# Altium schematic sheet Glucometer-E.C.- Full V1.1.SchDoc
size Letter; PageSetup: Record=PageOptions|CenterHorizontal=True|CenterVertical=True|PrintScale=0.95|XCorrection=1.00|YCorrection=1.00|PrintKind=2|BorderSize=5000000|LeftOffset=0|BottomOffset=0|Orientation=2|PaperLength=1000|PaperWidth=1000|Scale=100|PaperSource=7|PrintQuality=-4|MediaType=1|DitherType=10|PaperKind=Carta|PrintScaleMode=1
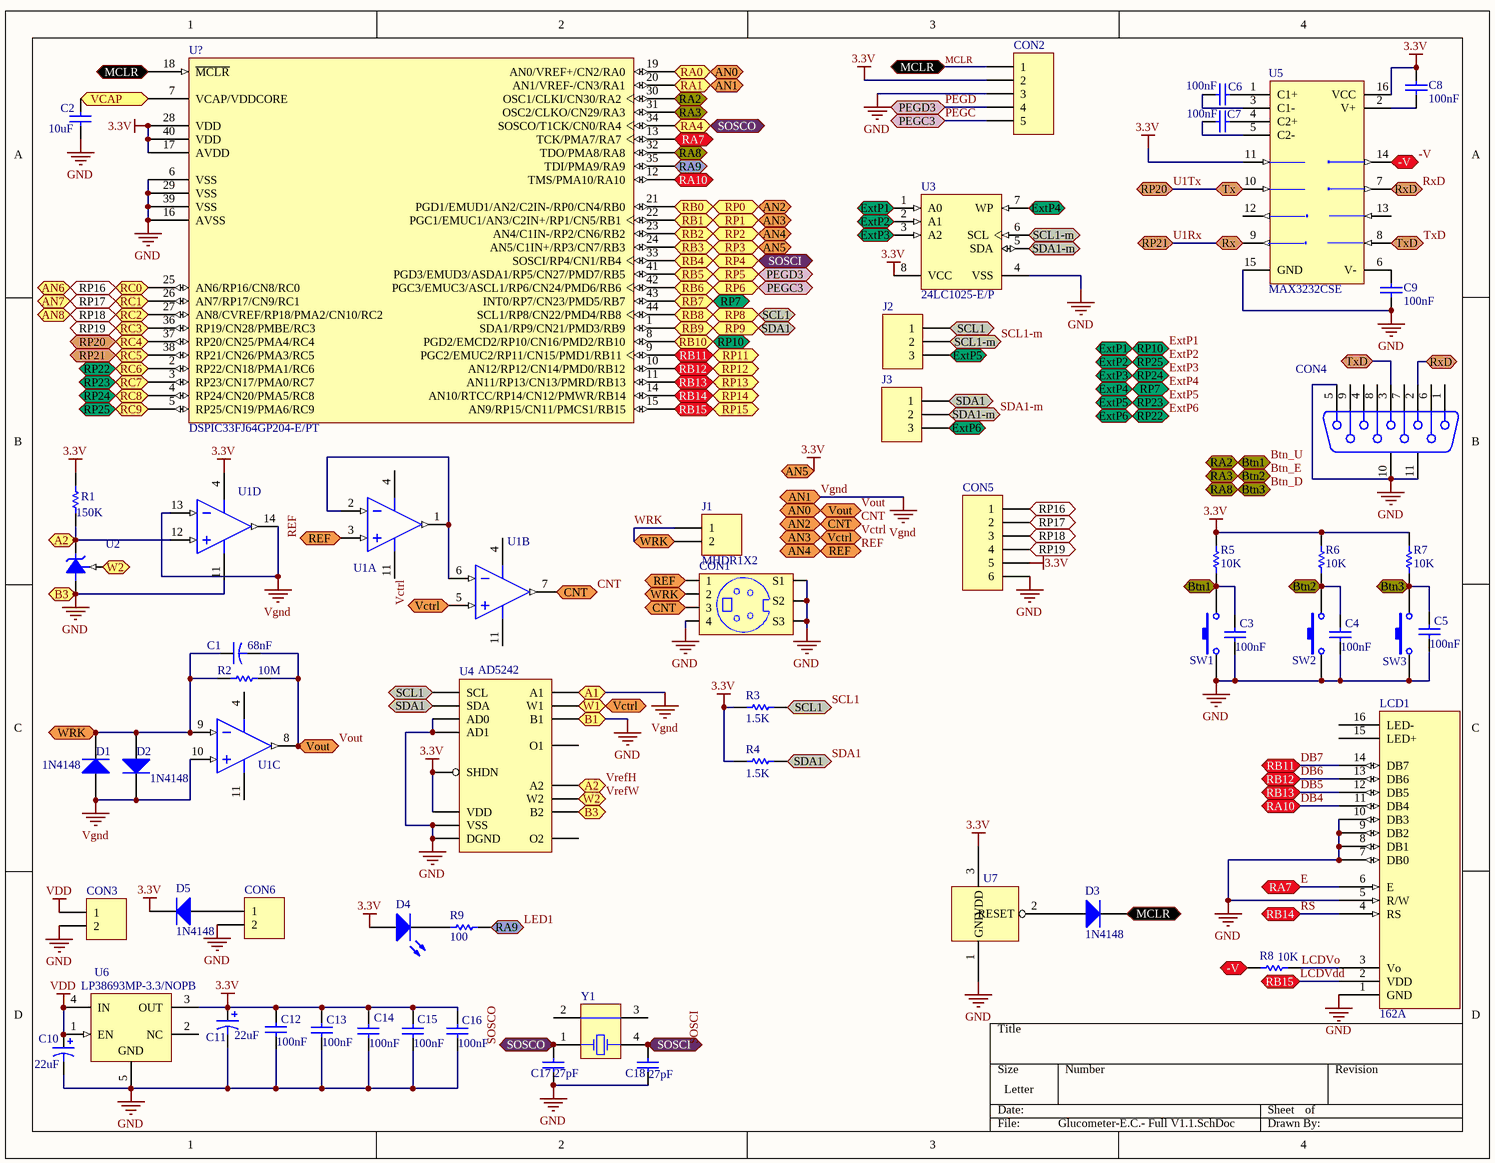
[diagram p0: Glucometer-E.C.- Full V1.1.SchDoc]

## Parts
C1  value 68nF  [CAPC1608N]  (hidden comment: Cap2)
C2  value 10uF  [CAPC2012N]  (hidden comment: Cap)
C3  value 100nF  [CAPC1608N]  (hidden comment: Cap)
C4  value 100nF  [CAPC1608N]  (hidden comment: Cap)
C5  value 100nF  [CAPC1608N]  (hidden comment: Cap)
C6  value 100nF  [RESC1608N]  (hidden comment: Cap)
C7  value 100nF  [RESC1608N]  (hidden comment: Cap)
C8  value 100nF  [RESC1608N]  (hidden comment: Cap)
C9  value 100nF  [RESC1608N]  (hidden comment: Cap)
C10  value 22uF  [C-4x4]  (hidden comment: Cap Pol2)
C11  value 22uF  [C-4x4]  (hidden comment: Cap Pol2)
C12  value 100nF  [CAPC1608N]  (hidden comment: Cap)
C13  value 100nF  [CAPC1608N]  (hidden comment: Cap)
C14  value 100nF  [CAPC1608N]  (hidden comment: Cap)
C15  value 100nF  [CAPC1608N]  (hidden comment: Cap)
C16  value 100nF  [CAPC1608N]  (hidden comment: Cap)
C17  value 27pF  [CAPC1608N]  (hidden comment: Cap)
C18  value 27pF  [CAPC1608N]  (hidden comment: Cap)
CON1  (no value)  [CDIN2.6-3H4A]
CON2  Header 5  [HDR1X5]  (value not drawn)
CON3  Header 2  [HDR1X2]  (value not drawn)
CON4  D Connector 9  [DSUB1.385-2H9]  (value not drawn)
CON5  Header 6  [HDR1X6]  (value not drawn)
CON6  Header 2  [HDR1X2]  (value not drawn)
D1  1N4148  [CD3216-1206]
D2  1N4148  [CD3216-1206]
D3  1N4148  [CD3216-1206]
D4  LED2  [3.2X1.6X1.1]  (value not drawn)
D5  1N4148  [DO-35]
J1  MHDR1X2  [MHDR1X2]
J2  Header 3  [HDR1X3]  (value not drawn)
J3  Header 3  [HDR1X3]  (value not drawn)
LCD1  162A  [HDR1X14]
R1  value 150K  [RESC3216N]  (hidden comment: Res1)
R2  value 10M  [RESC2012N]  (hidden comment: Res1)
R3  value 1.5K  [RESC2012N]  (hidden comment: Res1)
R4  value 1.5K  [RESC2012N]  (hidden comment: Res1)
R5  value 10K  [RESC2012N]  (hidden comment: Res1)
R6  value 10K  [RESC2012N]  (hidden comment: Res1)
R7  value 10K  [RESC2012N]  (hidden comment: Res1)
R8  value 10K  [RESC2012N]  (hidden comment: Res1)
R9  value 100  [RESC2012N]  (hidden comment: Res1)
SW1  SW-PB  [DPST-4]  (value not drawn)
SW2  SW-PB  [DPST-4]  (value not drawn)
SW3  SW-PB  [DPST-4]  (value not drawn)
U1  LMC6044IN  [M14A_N]  (value not drawn)  (parts A,B,C,D of 4)
U2  LM4041CEM3-ADJ/NOPB  [MF03A_N]  (value not drawn)
U3  24LC1025-E/P  [PDIP300-P8]
U4  AD5242  [R-16N_N]
U5  MAX3232CSE  [NSO16_N]
U6  LP38693MP-3.3/NOPB  [MP05A_N]
U7  Supply Voltage Supervisor  [SOT23]  (value not drawn)
U?  DSPIC33FJ64GP204-E/PT  [TQFP-PT44_N]
Y1  ECS-240-20-7S  [ECX-3S]  (value not drawn)

## Ports
-V, A1, A2, AN0, AN1, AN2, AN3, AN4, AN5, AN6, AN7, AN8, B1, B3, Btn1, Btn2, Btn3, CNT, ExtP1, ExtP2, ExtP3, ExtP4, ExtP5, ExtP6, MCLR, PEGC3, PEGD3, RA0, RA1, RA2, RA3, RA4, RA7, RA8, RA9, RA10, RB0, RB1, RB2, RB3, RB4, RB5, RB6, RB7, RB8, RB9, RB10, RB11, RB12, RB13, RB14, RB15, RC0, RC1, RC2, RC3, RC4, RC5, RC6, RC7, RC8, RC9, REF, RP0, RP1, RP2, RP3, RP4, RP5, RP6, RP7, RP8, RP9, RP10, RP11, RP12, RP13, RP14, RP15, RP16, RP17, RP18, RP19, RP20, RP21, RP22, RP23, RP24, RP25, Rx, RxD, SCL1, SCL1-m, SDA1, SDA1-m, SOSCI, SOSCO, Tx, TxD, VCAP, Vctrl, Vout, W1, W2, WRK

## Nets
3.3V: C8.1 C11.1 C12.2 C13.2 C14.2 C15.2 C16.2 CON2.2 CON5.5 D4.1(A) D5.2(K) R1.2 R3.1 R4.1 R5.2 R6.2 R7.2 U1.4(V+) U3.8(VCC) U4.5(VDD) U4.6(SHDN) U5.11(T1IN) U5.16(VCC) U6.3(OUT) U7.3(VDD) U?.17(AVDD) U?.24(AN5/C1IN+/RP3/CN7/RB3) U?.28(VDD) U?.40(VDD) ; port RP3, port RB3, port AN5
GND: C2.1 C3.1 C4.1 C5.1 C9.2 C10.2 C11.2 C12.1 C13.1 C14.1 C15.1 C16.1 C17.1 C18.1 CON1.4 CON1.MH1(S1) CON1.MH2(S2) CON1.MH3(S3) CON2.3 CON3.2 CON4.5 CON4.10(MH1) CON4.11(MH2) CON5.6 CON6.2 LCD1.1(GND) LCD1.5(R/W) LCD1.7(DB0) LCD1.8(DB1) LCD1.9(DB2) LCD1.10(DB3) SW1.1 SW2.1 SW3.1 U1.11(V-) U2.3(-V) U3.4(VSS) U4.4(B1) U4.9(AD0) U4.10(AD1) U4.11(DGND) U4.12(VSS) U4.14(B2) U5.15(GND) U6.5(GND) U7.1(GND) U?.6(VSS) U?.16(AVSS) U?.29(VSS) U?.39(VSS) ; port B1, port B3
VDD: C10.1 CON3.1 U6.1(EN) U6.4(IN)
Vgnd: D1.1(A) D2.2(K) U1.10(IN3+) U1.13(IN4-) U1.14(OUT4) U4.2(A1) U?.20(AN1/VREF-/CN3/RA1) ; port RA1, port AN1, port A1
-V: R8.2 U5.14(T1OUT) ; port -V
AN6: CON5.1 U?.25(AN6/RP16/CN8/RC0) ; port RP16, port AN6, port RC0
AN7: CON5.2 U?.26(AN7/RP17/CN9/RC1) ; port AN7, port RC1, port RP17
AN8: CON5.3 U?.27(AN8/CVREF/RP18/PMA2/CN10/RC2) ; port AN8, port RC2, port RP18
Btn_D: C5.2 R7.1 SW3.2 U?.32(TDO/PMA8/RA8) ; port RA8, port Btn3
Btn_E: C4.2 R6.1 SW2.2 U?.31(OSC2/CLKO/CN29/RA3) ; port RA3, port Btn2
Btn_U: C3.2 R5.1 SW1.2 U?.30(OSC1/CLKI/CN30/RA2) ; port Btn1, port RA2
CNT: CON1.3 U1.7(OUT2) U?.21(PGD1/EMUD1/AN2/C2IN-/RP0/CN4/RB0) ; port RB0, port RP0, port CNT, port AN2
DB4: LCD1.11(DB4) U?.12(TMS/PMA10/RA10) ; port RA10
DB5: LCD1.12(DB5) U?.11(AN11/RP13/CN13/PMRD/RB13) ; port RP13, port RB13
DB6: LCD1.13(DB6) U?.10(AN12/RP12/CN14/PMD0/RB12) ; port RP12, port RB12
DB7: LCD1.14(DB7) U?.9(PGC2/EMUC2/RP11/CN15/PMD1/RB11) ; port RP11, port RB11
E: LCD1.6(E) U?.13(TCK/PMA7/RA7) ; port RA7
ExtP1: U3.1(A0) U?.8(PGD2/EMCD2/RP10/CN16/PMD2/RB10) ; port RB10, port ExtP1, port RP10
ExtP2: U3.2(A1) U?.5(RP25/CN19/PMA6/RC9) ; port ExtP2, port RC9, port RP25
ExtP3: U3.3(A2) U?.4(RP24/CN20/PMA5/RC8) ; port ExtP3, port RC8, port RP24
ExtP4: U3.7(WP) U?.43(INT0/RP7/CN23/PMD5/RB7) ; port RB7, port ExtP4, port RP7
ExtP5: J2.3 U?.3(RP23/CN17/PMA0/RC7) ; port ExtP5, port RC7, port RP23
ExtP6: J3.3 U?.2(RP22/CN18/PMA1/RC6) ; port ExtP6, port RC6, port RP22
LCDVdd: LCD1.2(VDD) U?.15(AN9/RP15/CN11/PMCS1/RB15) ; port RP15, port RB15
LCDVo: LCD1.3(Vo) R8.1
LED1: R9.1 U?.35(TDI/PMA9/RA9) ; port RA9
MCLR: CON2.1 D3.2(K) U?.18(~{MCLR}) ; port MCLR
PEGC: CON2.5 U?.42(PGC3/EMUC3/ASCL1/RP6/CN24/PMD6/RB6) ; port RB6, port RP6, port PEGC3
PEGD: CON2.4 U?.41(PGD3/EMUD3/ASDA1/RP5/CN27/PMD7/RB5) ; port RB5, port RP5, port PEGD3
RC3: CON5.4 U?.36(RP19/CN28/PMBE/RC3) ; port RC3, port RP19
REF: CON1.1 U1.3(IN1+) U?.23(AN4/C1IN-/RP2/CN6/RB2) ; port RB2, port RP2, port REF, port AN4
RS: LCD1.4(RS) U?.14(AN10/RTCC/RP14/CN12/PMWR/RB14) ; port RP14, port RB14
RxD: CON4.2 U5.7(T2OUT) ; port RxD
SCL1: J2.1 R3.2 U4.7(SCL) U?.44(SCL1/RP8/CN22/PMD4/RB8) ; port RP8, port SCL1, port RB8
SCL1-m: J2.2 U3.6(SCL) ; port SCL1-m
SDA1: J3.1 R4.2 U4.8(SDA) U?.1(SDA1/RP9/CN21/PMD3/RB9) ; port RP9, port SDA1, port RB9
SDA1-m: J3.2 U3.5(SDA) ; port SDA1-m
SOSCI: C18.2 U?.33(SOSCI/RP4/CN1/RB4) Y1.4(OSC2) ; port RP4, port RB4, port SOSCI
SOSCO: C17.2 U?.34(SOSCO/T1CK/CN0/RA4) Y1.1(OSC1) ; port RA4, port SOSCO
TxD: CON4.3 U5.8(R2IN) ; port TxD
U1Rx: U5.9(R2OUT) U?.38(RP21/CN26/PMA3/RC5) ; port RP21, port Rx, port RC5
U1Tx: U5.10(T2IN) U?.37(RP20/CN25/PMA4/RC4) ; port RP20, port Tx, port RC4
VCAP: C2.2 U?.7(VCAP/VDDCORE) ; port VCAP
Vctrl: U1.5(IN2+) U4.3(W1) U?.22(PGC1/EMUC1/AN3/C2IN+/RP1/CN5/RB1) ; port RB1, port RP1, port AN3, port Vctrl, port W1
Vout: C1.2 R2.1 U1.8(OUT3) U?.19(AN0/VREF+/CN2/RA0) ; port AN0, port Vout, port RA0
VrefH: R1.1 U1.12(IN4+) U2.2(+V) U4.16(A2) ; port A2
VrefW: U2.1(FB) U4.15(W2) ; port W2
WRK: C1.1 CON1.2 D1.2(K) D2.1(A) J1.1 J1.2 R2.2 U1.9(IN3-) ; port WRK
NetC6_1: C6.1 U5.1(C1+)
NetC6_2: C6.2 U5.3(C1-)
NetC7_1: C7.1 U5.4(C2+)
NetC7_2: C7.2 U5.5(C2-)
NetC8_2: C8.2 U5.2(V+)
NetC9_1: C9.1 U5.6(V-)
NetCON6_1: CON6.1 D5.1(A)
NetD3_1: D3.1(A) U7.2(RESET)
NetD4_2: D4.2(K) R9.2
NetU1_1: U1.1(OUT1) U1.2(IN1-) U1.6(IN2-)

Not connected (* = marked no-connect by the designer): CON4 1 4 6 7 8 9; LCD1 15(LED+) 16(LED-); U4 1(O1) 13(O2); U5 12(R1OUT) 13(R1IN); U6 2(NC); Y1 2(COM) 3(COM)

## Library data of the parts
C1 = Cap2: Capacitor; Published: 23-Sep-2002; PackageReference: CAPR5-4X5; Publisher: Altium Limited; PackageDescription: Capacitor; 2 Leads
C2-C9 C12-C18 = Cap: Capacitor; Published: 8-Jun-2000; LatestRevisionDate: 17-Jul-2002; LatestRevisionNote: Re-released for DXP Platform.; PackageReference: RAD-0.3; Publisher: Altium Limited; PackageDescription: Radial Cap, Thru-Hole; 2 Leads; 0.3 in Pin Spacing
C10 C11 = Cap Pol2: Polarized Capacitor (Axial); Published: 8-Jun-2000; LatestRevisionDate: 17-Jul-2002; LatestRevisionNote: Re-released for DXP Platform.; PackageReference: POLAR0.8; Publisher: Altium Limited; PackageDescription: Polarized Capacitor; 2 Leads
CON1 = MiniDin 4Pins - SuperVideo: MiniDin 4 Pins
CON2 = Header 5: Header, 5-Pin; LatestRevisionDate: 17-Jul-2002; LatestRevisionNote: Re-released for DXP Platform.; Publisher: Altium Limited
CON3 CON6 = Header 2: Header, 2-Pin; LatestRevisionDate: 17-Jul-2002; LatestRevisionNote: Re-released for DXP Platform.; Publisher: Altium Limited
CON4 = D Connector 9: Receptacle Assembly, 9 Position, Right Angle; PackageDocument: O; Positions: 9; Published: 15-Jun-2001; LatestRevisionDate: 17-Jul-2002; LatestRevisionNote: Re-released for DXP Platform.; DatasheetDocument: 1-Sep-1999; PackageReference: 788750; Publisher: Altium Limited; Orientation: Right Angle; Gender: Receptacle
CON5 = Header 6: Header, 6-Pin; LatestRevisionDate: 17-Jul-2002; LatestRevisionNote: Re-released for DXP Platform.; Publisher: Altium Limited
D1-D3 D5 = 1N4148: High Conductance Fast Diode; Published: 8-Jun-2000; LatestRevisionDate: 17-Jul-2002; LatestRevisionNote: Re-released for DXP Platform.; DatasheetDocument: 1997; PackageReference: DO-35; Publisher: Altium Limited; Code_JEDEC: DO-204-AH; ComponentLink1Description: Manufacturer Link; ComponentLink1URL: http://www.fairchildsemi.com/; ComponentLink2Description: Datasheet; ComponentLink2URL: http://www.fairchildsemi.com/ds/1N%2F1N4148.pdf
D4 = LED2: Typical RED, GREEN, YELLOW, AMBER GaAs LED; Published: 8-Jun-2000; LatestRevisionDate: 17-Jul-2002; LatestRevisionNote: Re-released for DXP Platform.; PackageVersion: Feb-2002; PackageReference: 3.2X1.6X1.1; Publisher: Altium Limited; PackageDescription: SM LED; 2 Flat Leads
J1 = MHDR1X2: Header, 2-Pin; LatestRevisionDate: 17-Jul-2002; LatestRevisionNote: Re-released for DXP Platform.; Publisher: Altium Limited
J2 J3 = Header 3: Header, 3-Pin; LatestRevisionDate: 17-Jul-2002; LatestRevisionNote: Re-released for DXP Platform.; Publisher: Altium Limited
LCD1 = 162A: 16 char * 2 line LCD character display with b/light
R1-R9 = Res1: Resistor; Published: 8-Jun-2000; LatestRevisionDate: 17-Jul-2002; LatestRevisionNote: Re-released for DXP Platform.; PackageReference: AXIAL-0.3; Publisher: Altium Limited; PackageDescription: Axial Device, Thru-Hole; 2 Leads; 0.3 in Pin Spacing
SW1-SW3 = SW-PB: Switch; Published: 24-Mar-1999; LatestRevisionDate: 17-Jul-2002; LatestRevisionNote: Re-released for DXP Platform.; PackageReference: SPST-2; Publisher: Altium Limited; PackageDescription: Switch; 2 Leads
U1 = LMC6044IN: CMOS Quad Micropower Operational Amplifier, 14-pin MDIP; Manufacturer: National Semiconductor; PackageTopMarking: NSUZXYYTTE#*LMC6044IN; PowerWise: Y; CompType: Amplifiers; Published: 4-Dec-2008; LatestRevisionDate: 13-Jan-2009; LatestRevisionNote: Sim Model Added.; DatasheetVersion: Aug-2000; PackageVersion: revG, May-2006; PackageReference: N14A; Publisher: Altium Limited; PackageDescription: MDIP, .750 x .250 x.130in, 14 Lead, .100in Pitch; Supplier 1: Farnell; Supplier Part Number 1: 9494634; PartNumber: LMC6044IN; RoHS: N; PinCount: 14; Code_JEDEC: MS-001-AA; ComponentLink1Description: LMC6044 Datasheet; ComponentLink1URL: http://www.national.com/ds/LM/LMC6044.pdf; ComponentLink2Description: LMC6044 Web Page; ComponentLink2URL: http://www.national.com/pf/LM/LMC6044.html; ComponentLink3Description: N14A Package Page; ComponentLink3URL: http://www.national.com/packaging/folders/n14a.html
U2 = LM4041CEM3-ADJ/NOPB: Precision Micropower Shunt Voltage Reference, 3-pin SOT-23, Pb-Free; Manufacturer: National Semiconductor; PackageTopMarking: RAC*XTT; PowerWise: N; CompType: Voltage Reference IC; Published: 1-Mar-2010; DatasheetVersion: Mar-2005; PackageVersion: revB, Mar-2003; PackageReference: MF03A; Publisher: Altium Limited; PackageDescription: Molded SOT-23, .115 x .051 x .037in Body, 3 Lead, .075 in Pitch; Supplier 1: Digi-Key; Supplier Part Number 1: LM4041CEM3-ADJTR-ND; Supplier 2: Digi-Key; Supplier Part Number 2: LM4041CEM3-ADJCT-ND; Supplier 3: Digi-Key; Supplier Part Number 3: LM4041CEM3-ADJDKR-ND; Supplier 4: Farnell; Supplier Part Number 4: 1673994; PartNumber: LM4041CEM3-ADJ/NOPB; RoHS: Y; PinCount: 3; ComponentLink1Description: LM4041 Datasheet; ComponentLink1URL: http://www.national.com/ds/LM/LM4041.pdf; ComponentLink2Description: LM4041 Web Page; ComponentLink2URL: http://www.national.com/pf/LM/LM4041.html; ComponentLink3Description: MF03A Package Page; ComponentLink3URL: http://www.national.com/packaging/folders/mf03a.html
U3 = 24LC1025-E/P: 1 Mbit, 400kHz, 2.5V, I2C Serial EEPROM, 8-Pin PDIP, Extended Temperature; Published: 29-Jan-2009; DatasheetVersion: revF, Oct-2008; PackageVersion: revBB, Aug-2009; PackageReference: PDIP300-P8; Publisher: Altium Limited; PackageDescription: 8-Lead Plastic Dual In-Line (P) - 300 mil Body [PDIP]; Supplier 1: Digi-Key; Supplier Part Number 1: 24LC1025-E/P-ND; Supplier 2: Farnell; Supplier Part Number 2: 1815993; Code_JEDEC: MS-001; ComponentLink1Description: Datasheet; ComponentLink1URL: http://ww1.microchip.com/downloads/en/DeviceDoc/21941F.pdf; ComponentLink2Description: Packaging Specification; ComponentLink2URL: http://www.microchip.com/stellent/groups/techpub_sg/documents/packagingspec/en012702.pdf; ComponentLink3Description: Microchip.com Home; ComponentLink3URL: http://www.microchip.com/
U4 = AD5242: AD5242BR
U5 = MAX3232CSE: 3.0V TO 5.5V, Low-Power, up to 1Mbps, True RS-232 Transceiver Using Four 0.1µF External Capacitor; Published: 16-Jan-2001; LatestRevisionDate: 13-Apr-2006; LatestRevisionNote: IPC-7351 Footprint Added.; DatasheetVersion: Mar-1999; PackageReference: NSO16; Publisher: Altium Limited; PackageDescription: 16-Pin Small Outline Integrated Circuit 1.27 mm Pitch; Code_JEDEC: MS-012-AC; Code_IPC: SOIC127P600-16; ComponentLink1Description: Manufacturer Link; ComponentLink1URL: http://www.maxim-ic.com/; ComponentLink2Description: Datasheet; ComponentLink2URL: http://pdfserv.maxim-ic.com/en/ds/MAX3222-MAX3241.pdf
U6 = LP38693MP-3.3/NOPB: 500mA Low Dropout CMOS Linear Regulators Stable with Ceramic Output Capacitors, 5-pin SOT-223, Pb-Free; Manufacturer: National Semiconductor; PackageTopMarking: XYTT*LJYB; PowerWise: Y; CompType: LDO IC; Published: 1-Mar-2010; DatasheetVersion: Sep-2005; PackageVersion: revA, Jan-2000; PackageReference: MP05A; Publisher: Altium Limited; PackageDescription: Moldec SOT-223, 6.50 x 3.56 x 1.6mm Body, 5 Lead, 1.5mm Pitch; Supplier 1: Digi-Key; Supplier Part Number 1: LP38693MP-3.3TR-ND; Supplier 2: Digi-Key; Supplier Part Number 2: LP38693MP-3.3CT-ND; Supplier 3: Digi-Key; Supplier Part Number 3: LP38693MP-3.3DKR-ND; Supplier 4: Farnell; Supplier Part Number 4: 1559648; PartNumber: LP38693MP-3.3/NOPB; RoHS: Y; PinCount: 5; Code_JEDEC: TO-261-AB; Code_IPC: SOT223-5; ComponentLink1Description: LP38693 Datasheet; ComponentLink1URL: http://www.national.com/ds/LP/LP38693.pdf; ComponentLink2Description: LP38693 Web Page; ComponentLink2URL: http://www.national.com/pf/LP/LP38693.html; ComponentLink3Description: MP05A Package Page; ComponentLink3URL: http://www.national.com/packaging/folders/mp05a.html
U? = DSPIC33FJ64GP204-E/PT: High-Performance 16-bit Digital Signal Controller, 64 KB Flash, 8 KB RAM, 44-Pin TQFP, Extended High Temperature; Published: 29-Jan-2009; LatestRevisionDate: 02-Dec-2009; LatestRevisionNote: Updated to datasheet revision D, Nov-2009; DatasheetVersion: revD, Nov-2009; PackageVersion: revBB, Aug-2009; PackageReference: TQFP-PT44; Publisher: Altium Limited; PackageDescription: 44-Lead Plastic Thin Quad Flatpack (PT) - 10x10x1mm Body, 2.00mm [TQFP]; Supplier 1: Digi-Key; Supplier Part Number 1: DSPIC33FJ64GP204-E/PT-ND; Code_JEDEC: MS-026; ComponentLink1Description: Datasheet; ComponentLink1URL: http://ww1.microchip.com/downloads/en/DeviceDoc/70292D.pdf; ComponentLink2Description: Packaging Specification; ComponentLink2URL: http://www.microchip.com/stellent/groups/techpub_sg/documents/packagingspec/en012702.pdf; ComponentLink3Description: Microchip.com Home; ComponentLink3URL: http://www.microchip.com/
Y1 = ECS-240-20-7S: Crystal Oscillator; Published: 17-Jul-2002; DatasheetDocument: 18-Apr-2000; PackageReference: ECX-3S; Publisher: Altium Limited; ComponentLink1Description: Manufacturer Link; ComponentLink1URL: http://www.ecsxtal.com/; ComponentLink2Description: Datasheet; ComponentLink2URL: http://www.ecsxtal.com/pdf/ecx-3s.pdf